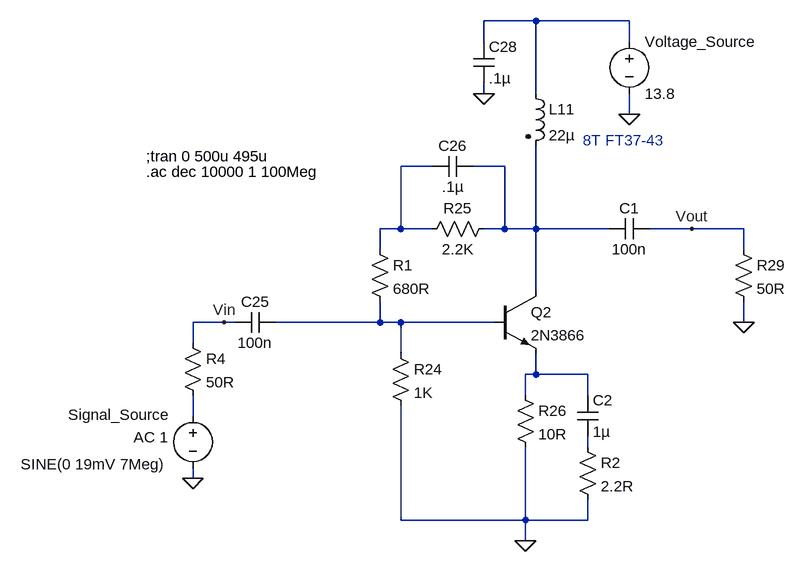
[diagram p0: schematic Power Amp Driver Stage.asc]
Power Amp Driver Stage.asc, the LTspice schematic file:
Version 4
SHEET 1 2548 2288
WIRE 336 1392 256 1392
WIRE 480 1392 336 1392
WIRE 256 1424 256 1392
WIRE 480 1424 480 1392
WIRE 256 1504 256 1488
WIRE 336 1504 336 1392
WIRE 480 1536 480 1504
WIRE 176 1616 128 1616
WIRE 288 1616 240 1616
WIRE 128 1712 128 1616
WIRE 128 1712 96 1712
WIRE 176 1712 128 1712
WIRE 288 1712 288 1616
WIRE 288 1712 256 1712
WIRE 336 1712 336 1584
WIRE 336 1712 288 1712
WIRE 448 1712 336 1712
WIRE 576 1712 512 1712
WIRE 656 1712 576 1712
WIRE 96 1744 96 1712
WIRE 656 1744 656 1712
WIRE 336 1808 336 1712
WIRE -144 1856 -192 1856
WIRE -128 1856 -144 1856
WIRE 96 1856 96 1824
WIRE 96 1856 -64 1856
WIRE 128 1856 96 1856
WIRE 272 1856 128 1856
WIRE 656 1856 656 1824
WIRE -192 1888 -192 1856
WIRE 128 1904 128 1856
WIRE 336 1936 336 1904
WIRE 336 1936 320 1936
WIRE 416 1936 336 1936
WIRE 320 1968 320 1936
WIRE 416 1968 416 1936
WIRE -192 2000 -192 1968
WIRE 416 2048 416 2032
WIRE -192 2096 -192 2080
WIRE 128 2160 128 1984
WIRE 320 2160 320 2048
WIRE 320 2160 128 2160
WIRE 416 2160 416 2128
WIRE 416 2160 320 2160
WIRE 320 2192 320 2160
FLAG -192 2096 0
FLAG 480 1536 0
FLAG 256 1504 0
FLAG 656 1856 0
FLAG -144 1856 Vin
FLAG 576 1712 Vout
FLAG 320 2192 0
SYMBOL voltage -192 1984 R0
WINDOW 3 -265 90 Left 2
WINDOW 123 -91 49 Left 2
WINDOW 0 -192 14 Left 2
WINDOW 39 0 0 Left 2
SYMATTR Value SINE(0 19mV 7Meg)
SYMATTR Value2 AC 1
SYMATTR InstName Signal_Source
SYMBOL res -208 1872 R0
SYMATTR InstName R4
SYMATTR Value 50R
SYMBOL npn 272 1808 R0
SYMATTR InstName Q2
SYMATTR Value 2N3866
SYMBOL cap -64 1840 R90
WINDOW 0 0 32 VBottom 2
WINDOW 3 32 32 VTop 2
SYMATTR InstName C25
SYMATTR Value 100n
SYMBOL voltage 480 1408 R0
WINDOW 123 0 0 Left 2
WINDOW 39 0 0 Left 2
SYMATTR InstName Voltage_Source
SYMATTR Value 13.8
SYMBOL res 112 1888 R0
SYMATTR InstName R24
SYMATTR Value 1K
SYMBOL res 272 1696 R90
WINDOW 0 0 56 VBottom 2
WINDOW 3 32 56 VTop 2
SYMATTR InstName R25
SYMATTR Value 2.2K
SYMBOL cap 240 1600 R90
WINDOW 0 0 32 VBottom 2
WINDOW 3 32 32 VTop 2
SYMATTR InstName C26
SYMATTR Value .1µ
SYMBOL ind2 320 1488 R0
SYMATTR InstName L11
SYMATTR Value 22µ
SYMATTR Type ind
SYMBOL res 304 1952 R0
SYMATTR InstName R26
SYMATTR Value 10R
SYMBOL cap 240 1424 R0
SYMATTR InstName C28
SYMATTR Value .1µ
SYMBOL res 640 1728 R0
SYMATTR InstName R29
SYMATTR Value 50R
SYMBOL cap 512 1696 R90
WINDOW 0 0 32 VBottom 2
WINDOW 3 32 32 VTop 2
SYMATTR InstName C1
SYMATTR Value 100n
SYMBOL res 80 1728 R0
SYMATTR InstName R1
SYMATTR Value 680R
SYMBOL cap 400 1968 R0
SYMATTR InstName C2
SYMATTR Value 1µ
SYMBOL res 400 2032 R0
SYMATTR InstName R2
SYMATTR Value 2.2R
TEXT -264 1600 Left 2 !;tran 0 500u 495u
TEXT -264 1624 Left 2 !.ac dec 10000 1 100Meg
TEXT 408 1576 Left 2 ;8T FT37-43

The netlist it stands for:
* Power Amp Driver Stage.asc
V§Signal_Source N006 0 SINE(0 19mV 7Meg) AC 1
R4 Vin N006 50R
Q2 N003 N004 N005 0 2N3866
C25 N004 Vin 100n
Voltage_Source N001 0 13.8
R24 N004 0 1K
R25 N003 N002 2.2K
C26 N003 N002 .1µ
L11 N001 N003 22µ
R26 N005 0 10R
C28 N001 0 .1µ
R29 Vout 0 50R
C1 Vout N003 100n
R1 N002 N004 680R
C2 N005 N007 1µ
R2 N007 0 2.2R
.model NPN NPN
.model PNP PNP
.lib standard.bjt
;tran 0 500u 495u
.ac dec 10000 1 100Meg
* 8T FT37-43
.backanno
.end